# EAGLE design bootloader1 (EAGLE 9.6.2)
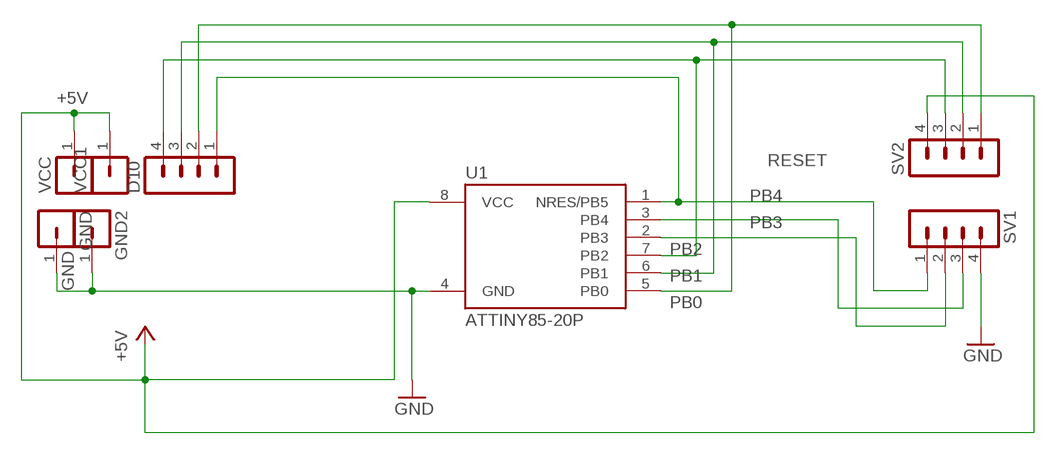
[diagram p0: schematic, sheet 1]

## Parts
D10  PINHEAD-MA04-1  [PINHEAD-MA04-1]
GND  PINHEAD-MA01-1  [PINHEAD-MA01-1]
GND2  PINHEAD-MA01-1  [PINHEAD-MA01-1]
SV1  PINHEAD-MA04-1  [PINHEAD-MA04-1]
SV2  PINHEAD-MA04-1  [PINHEAD-MA04-1]
U1  ATTINY85-20P  [PDIP08_300MIL]
VCC  PINHEAD-MA01-1  [PINHEAD-MA01-1]
VCC1  PINHEAD-MA01-1  [PINHEAD-MA01-1]

## Nets
+5V: SV2.4 U1.8(VCC) VCC1.1 VCC.1
GND: GND2.1 GND.1 SV1.4 U1.4(GND)
PB0: D10.2 SV2.1 U1.5(PB0)
PB1: D10.3 SV2.2 U1.6(PB1)
PB2: D10.4 SV2.3 U1.7(PB2)
PB3: SV1.2 U1.2(PB3)
PB4: SV1.3 U1.3(PB4)
RESET: D10.1 SV1.1 U1.1(NRES/PB5)

## Library data of the parts
D10 SV1 SV2 = ytani1:PINHEAD-MA04-1: PIN HEADER; OC_FARNELL: unknown; OC_NEWARK: unknown
GND GND2 VCC VCC1 = ytani1:PINHEAD-MA01-1
U1 = _hhn_attiny25_45_85:ATTINY85*: ATMEL ATtiny 85 Packages: P = PDIP 08 30mil S = SOIC 08 EIAJ 208mil Technologies Note: for complete ordering code (temp. range, finish, tape&reel etc.) see www.atmel.com • Supply Voltage: V = (1.8…5.5)V | [blank] = (2.7…5.5)V • Speed: 10 = 10 MHz | 20 = 20 MHz Author: Dipl.-Ing. FH Rainer Bayer HHN Hochschule Heilbronn (Heilbronn University), rainer.bayer@hs-heilbronn.de Ingenieurbüro ing-rb, mail@ing-rb.de

## Board
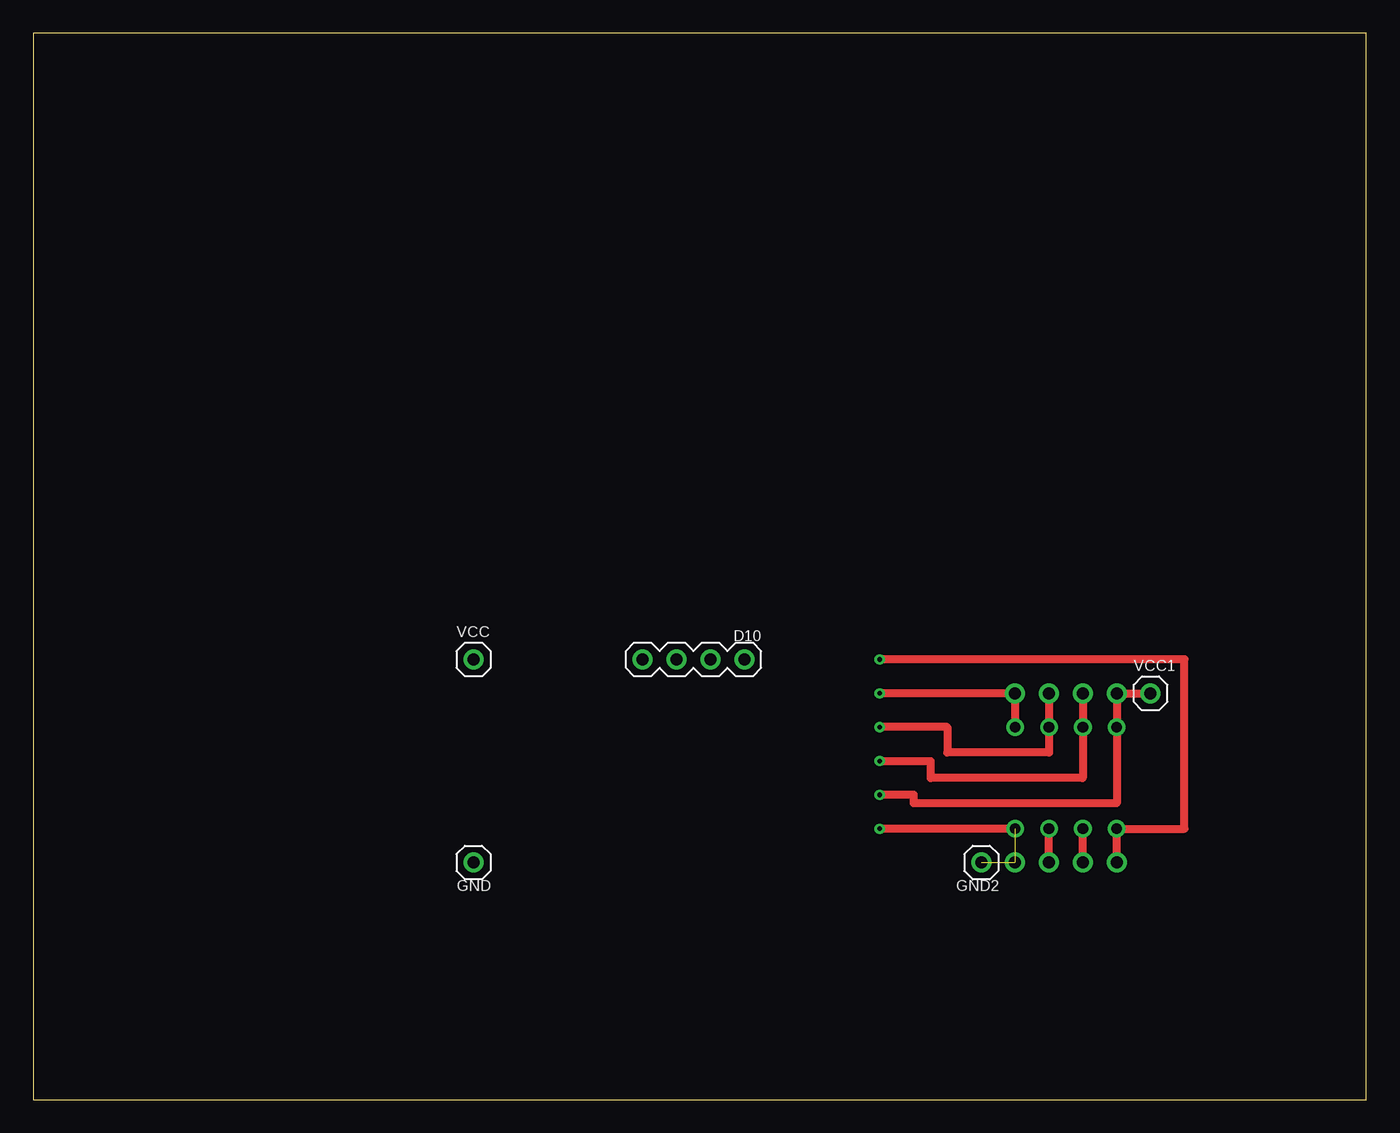
[diagram p1: board, top side]
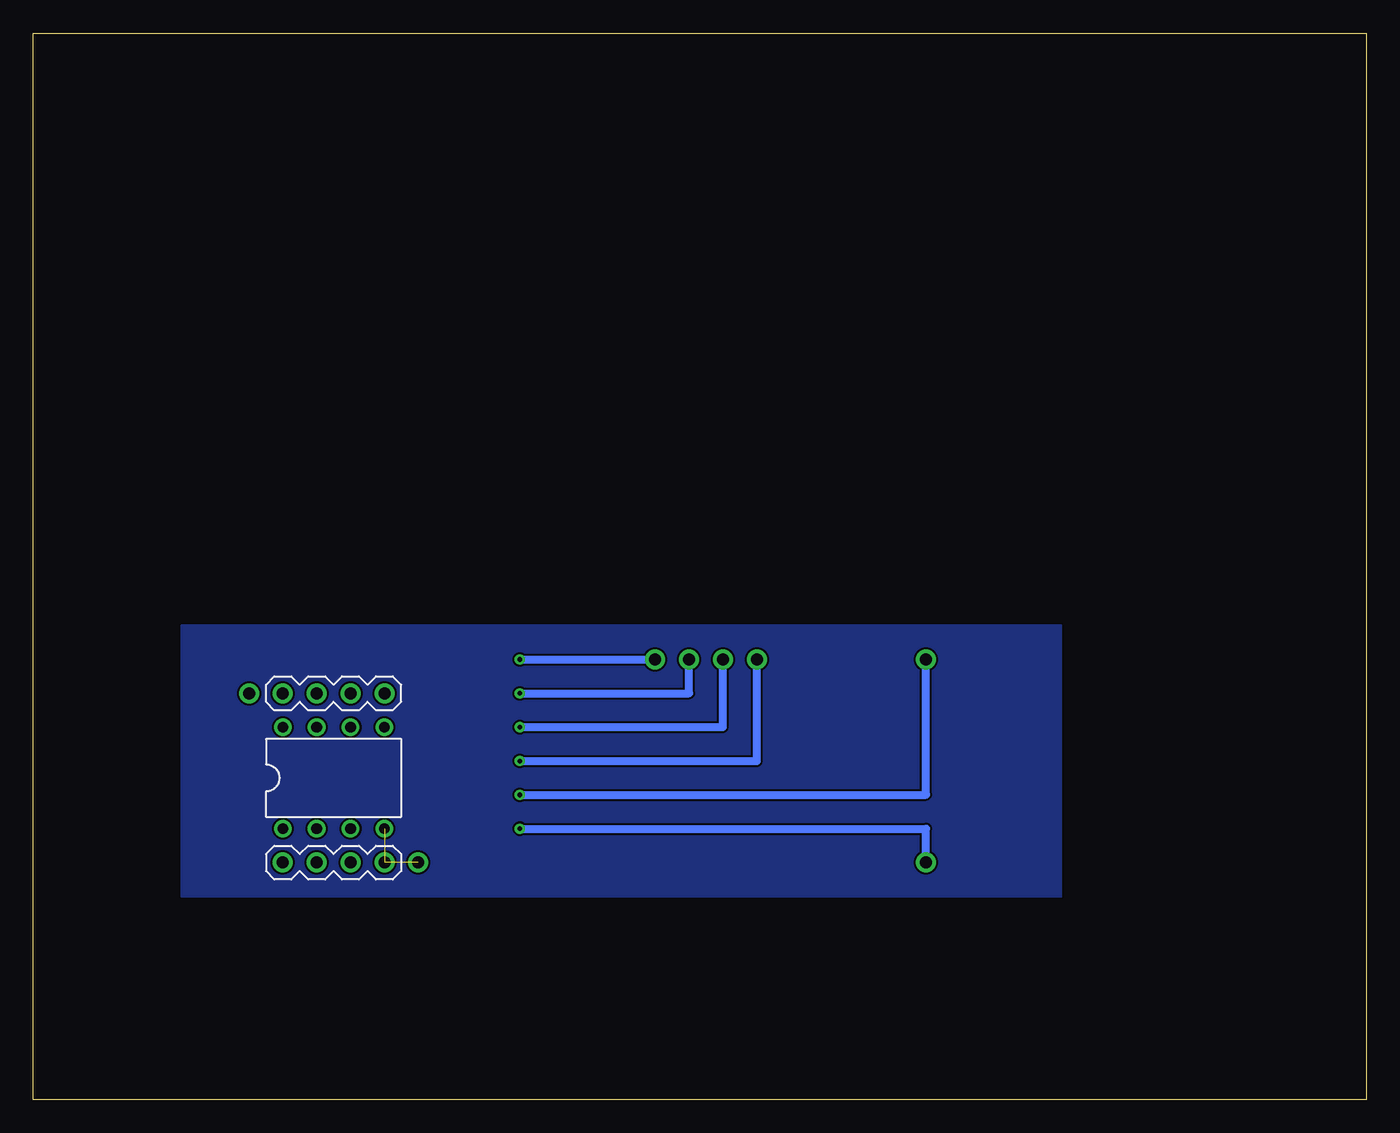
[diagram p2: board, bottom side, seen from below]

Size 100 x 80 mm. Coordinates in mm from the lower left corner, seen from the top.
Outline: 0,0 100,0 100,80 0,80 0,0
Copper layers (1*16): Top 0.035mm / dielectric 1.5mm / Bottom 0.035mm
Design rules "default": minimum track width 6mil, minimum drill 0.35mm, track to track 6mil, track to pad 6mil, pad to pad 6mil, via to via 6mil, smd to smd 6mil, copper to edge 40mil, drill to drill 6mil, minimum pad ring 10mil, minimum via ring 8mil, stop-mask expansion 4mil, vias tented up to drill 0mil, thermal gap 10mil

### Footprints (pad centres in the part's own frame; a part is rotated, then mirrored left to right if it is on the bottom)
PINHEAD-MA04-1 = drill 0.9 pad 1.5: 1 -3.81,0; 2 -1.27,0; 3 1.27,0; 4 3.81,0
PINHEAD-MA01-1 = drill 0.9 pad 1.5: 1 1.27,0
PDIP08_300MIL = drill 0.813: 1 -3.81,-3.81; 2 -1.27,-3.81; 3 1.27,-3.81; 4 3.81,-3.81; 5 3.81,3.81; 6 1.27,3.81; 7 -1.27,3.81; 8 -3.81,3.81

### Placement (x,y rotation side)
D10  49.53,33.02 180 top
GND  31.75,17.78 0 top
GND2  69.85,17.78 0 top
SV1  77.47,17.78 0 bottom
SV2  77.47,30.48 180 bottom
U1  77.47,24.13 0 bottom
VCC  31.75,33.02 0 top
VCC1  85.09,30.48 180 top

### Tracks (layer width: path | path; a pad name or v marks a point on that pad's centre or on a via)
+5V  (via drill 0.35)
  Top 0.61: VCC1.1 SV2.4 U1.8 81.28,22.23 66.04,22.23 66.04,22.86 v63.5,22.86
  Bottom 0.61: v63.5,22.86 33.02,22.86 VCC.1
AA
  pour Bottom: 22.86,35.56 88.9,35.56 88.9,15.24 22.86,15.24
GND  (via drill 0.35)  (2 unrouted)
  Top 0.61: U1.4 v63.5,20.32
  Bottom 0.61: v63.5,20.32 33.02,20.32 GND.1
PB0  (via drill 0.35)
  Top 0.61: U1.5 SV2.1 v63.5,30.48
  Bottom 0.61: v63.5,30.48 50.8,30.48 D10.2
PB1  (via drill 0.35)
  Top 0.61: SV2.2 U1.6 76.2,26.04 68.58,26.04 68.58,27.94 v63.5,27.94
  Bottom 0.61: v63.5,27.94 48.26,27.94 D10.3
PB2  (via drill 0.35)
  Top 0.61: SV2.3 U1.7 78.74,24.13 67.31,24.13 67.31,25.4 v63.5,25.4
  Bottom 0.61: v63.5,25.4 45.72,25.4 D10.4
PB3
  Top 0.61: SV1.2 U1.2
PB4
  Top 0.61: SV1.3 U1.3
RESET  (via drill 0.35)
  Top 0.61: SV1.1 U1.1 86.36,20.32 86.36,33.02 v63.5,33.02
  Bottom 0.61: v63.5,33.02 D10.1